# Altium schematic sheet buttonInput.SchDoc
size A
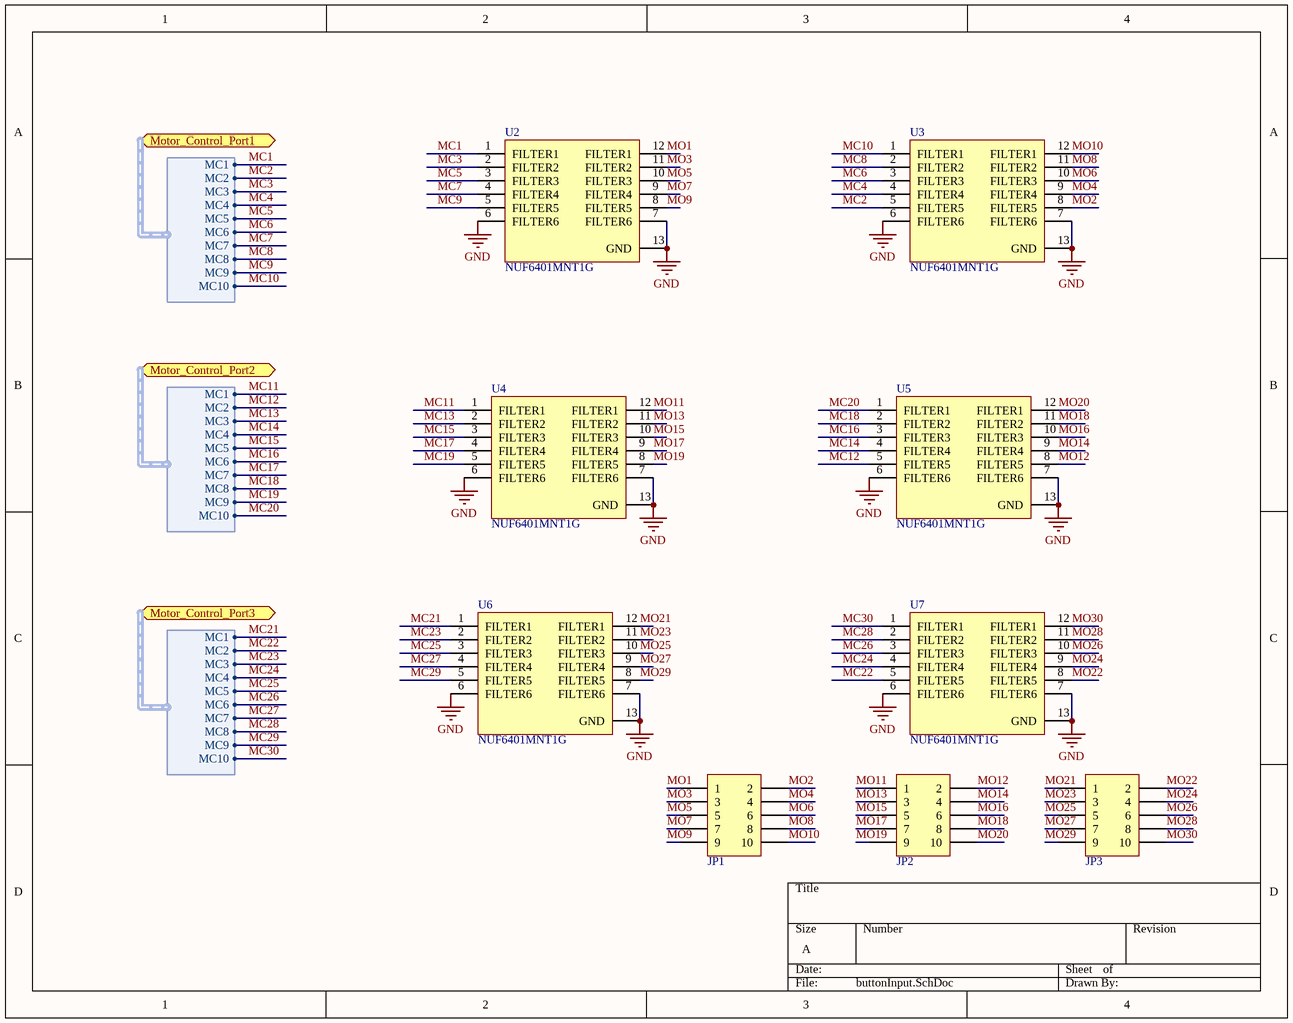
[diagram p0: buttonInput.SchDoc]

## Parts
JP1  Header 5x2 2.54mm  [2X5]  (value not drawn)
JP2  Header 5x2 2.54mm  [2X5]  (value not drawn)
JP3  Header 5x2 2.54mm  [2X5]  (value not drawn)
U2  NUF6401MNT1G  [ONSC-DFN-12-506AD-01_V]
U3  NUF6401MNT1G  [ONSC-DFN-12-506AD-01_V]
U4  NUF6401MNT1G  [ONSC-DFN-12-506AD-01_V]
U5  NUF6401MNT1G  [ONSC-DFN-12-506AD-01_V]
U6  NUF6401MNT1G  [ONSC-DFN-12-506AD-01_V]
U7  NUF6401MNT1G  [ONSC-DFN-12-506AD-01_V]

## Ports
Motor_Control_Port1 (harness MCP), Motor_Control_Port2 (harness MCP), Motor_Control_Port3 (harness MCP)

## Harnesses
MCP: MC1, MC2, MC3, MC4, MC5, MC6, MC7, MC8, MC9, MC10

## Nets
GND: U2.6(FILTER6) U2.7(FILTER6) U2.13(GND) U3.6(FILTER6) U3.7(FILTER6) U3.13(GND) U4.6(FILTER6) U4.7(FILTER6) U4.13(GND) U5.6(FILTER6) U5.7(FILTER6) U5.13(GND) U6.6(FILTER6) U6.7(FILTER6) U6.13(GND) U7.6(FILTER6) U7.7(FILTER6) U7.13(GND)
MC1: U2.1(FILTER1) ; port Motor_Control_Port1.MC1
MC2: U3.5(FILTER5) ; port Motor_Control_Port1.MC2
MC3: U2.2(FILTER2) ; port Motor_Control_Port1.MC3
MC4: U3.4(FILTER4) ; port Motor_Control_Port1.MC4
MC5: U2.3(FILTER3) ; port Motor_Control_Port1.MC5
MC6: U3.3(FILTER3) ; port Motor_Control_Port1.MC6
MC7: U2.4(FILTER4) ; port Motor_Control_Port1.MC7
MC8: U3.2(FILTER2) ; port Motor_Control_Port1.MC8
MC9: U2.5(FILTER5) ; port Motor_Control_Port1.MC9
MC10: U3.1(FILTER1) ; port Motor_Control_Port1.MC10
MC11: U4.1(FILTER1) ; port Motor_Control_Port2.MC1
MC12: U5.5(FILTER5) ; port Motor_Control_Port2.MC2
MC13: U4.2(FILTER2) ; port Motor_Control_Port2.MC3
MC14: U5.4(FILTER4) ; port Motor_Control_Port2.MC4
MC15: U4.3(FILTER3) ; port Motor_Control_Port2.MC5
MC16: U5.3(FILTER3) ; port Motor_Control_Port2.MC6
MC17: U4.4(FILTER4) ; port Motor_Control_Port2.MC7
MC18: U5.2(FILTER2) ; port Motor_Control_Port2.MC8
MC19: U4.5(FILTER5) ; port Motor_Control_Port2.MC9
MC20: U5.1(FILTER1) ; port Motor_Control_Port2.MC10
MC21: U6.1(FILTER1) ; port Motor_Control_Port3.MC1
MC22: U7.5(FILTER5) ; port Motor_Control_Port3.MC2
MC23: U6.2(FILTER2) ; port Motor_Control_Port3.MC3
MC24: U7.4(FILTER4) ; port Motor_Control_Port3.MC4
MC25: U6.3(FILTER3) ; port Motor_Control_Port3.MC5
MC26: U7.3(FILTER3) ; port Motor_Control_Port3.MC6
MC27: U6.4(FILTER4) ; port Motor_Control_Port3.MC7
MC28: U7.2(FILTER2) ; port Motor_Control_Port3.MC8
MC29: U6.5(FILTER5) ; port Motor_Control_Port3.MC9
MC30: U7.1(FILTER1) ; port Motor_Control_Port3.MC10
MO1: JP1.1 U2.12(FILTER1)
MO2: JP1.2 U3.8(FILTER5)
MO3: JP1.3 U2.11(FILTER2)
MO4: JP1.4 U3.9(FILTER4)
MO5: JP1.5 U2.10(FILTER3)
MO6: JP1.6 U3.10(FILTER3)
MO7: JP1.7 U2.9(FILTER4)
MO8: JP1.8 U3.11(FILTER2)
MO9: JP1.9 U2.8(FILTER5)
MO10: JP1.10 U3.12(FILTER1)
MO11: JP2.1 U4.12(FILTER1)
MO12: JP2.2 U5.8(FILTER5)
MO13: JP2.3 U4.11(FILTER2)
MO14: JP2.4 U5.9(FILTER4)
MO15: JP2.5 U4.10(FILTER3)
MO16: JP2.6 U5.10(FILTER3)
MO17: JP2.7 U4.9(FILTER4)
MO18: JP2.8 U5.11(FILTER2)
MO19: JP2.9 U4.8(FILTER5)
MO20: JP2.10 U5.12(FILTER1)
MO21: JP3.1 U6.12(FILTER1)
MO22: JP3.2 U7.8(FILTER5)
MO23: JP3.3 U6.11(FILTER2)
MO24: JP3.4 U7.9(FILTER4)
MO25: JP3.5 U6.10(FILTER3)
MO26: JP3.6 U7.10(FILTER3)
MO27: JP3.7 U6.9(FILTER4)
MO28: JP3.8 U7.11(FILTER2)
MO29: JP3.9 U6.8(FILTER5)
MO30: JP3.10 U7.12(FILTER1)

## Library data of the parts
JP1-JP3 = Header 5x2: Header, 8-Pin; Supplier 1: Farnell; Supplier Part Number 1: 1593440
U2-U7 = CMP-1066-00005-1: 6-Channel EMI Filter with Integrated ESD Protection, -40 to 105 degC, 12-Pin DFN, Pb-Free, Tape and Reel; Manufacturer: On Semiconductor; Number of Lines: 6; VRWM Max (V): 5; V(BR) Typ (V): 7; PackageReference: DFN-12-506AD-01; PartNumber: NUF6401MNT1G; ComponentLink3Description: Package Specification; RoHS: Pb-Free; Mounting Technology: Surface Mount; ComponentLink2Description: Datasheet; ComponentLink1Description: Manufacturer URL; PackageDescription: 12-Pin Small Outline No-Lead, Body 3 x 1.35 mm, Pitch 0.5 mm; Packing: Tape and Reel; DatasheetVersion: Rev. 2; ComponentLink2URL: http://www.onsemi.com/pub_link/Collateral/NUF6401-D.PDF; PackageVersion: Rev. J, 07/2008; ComponentLink3URL: http://www.onsemi.com/pub_link/Collateral/506AD.PDF; ComponentLink1URL: http://www.onsemi.com/; Supplier 1: Digi-Key; Supplier Part Number 1: NUF6401MNT1GOSCT-ND